# EAGLE design Mini-Q (EAGLE 6.4)
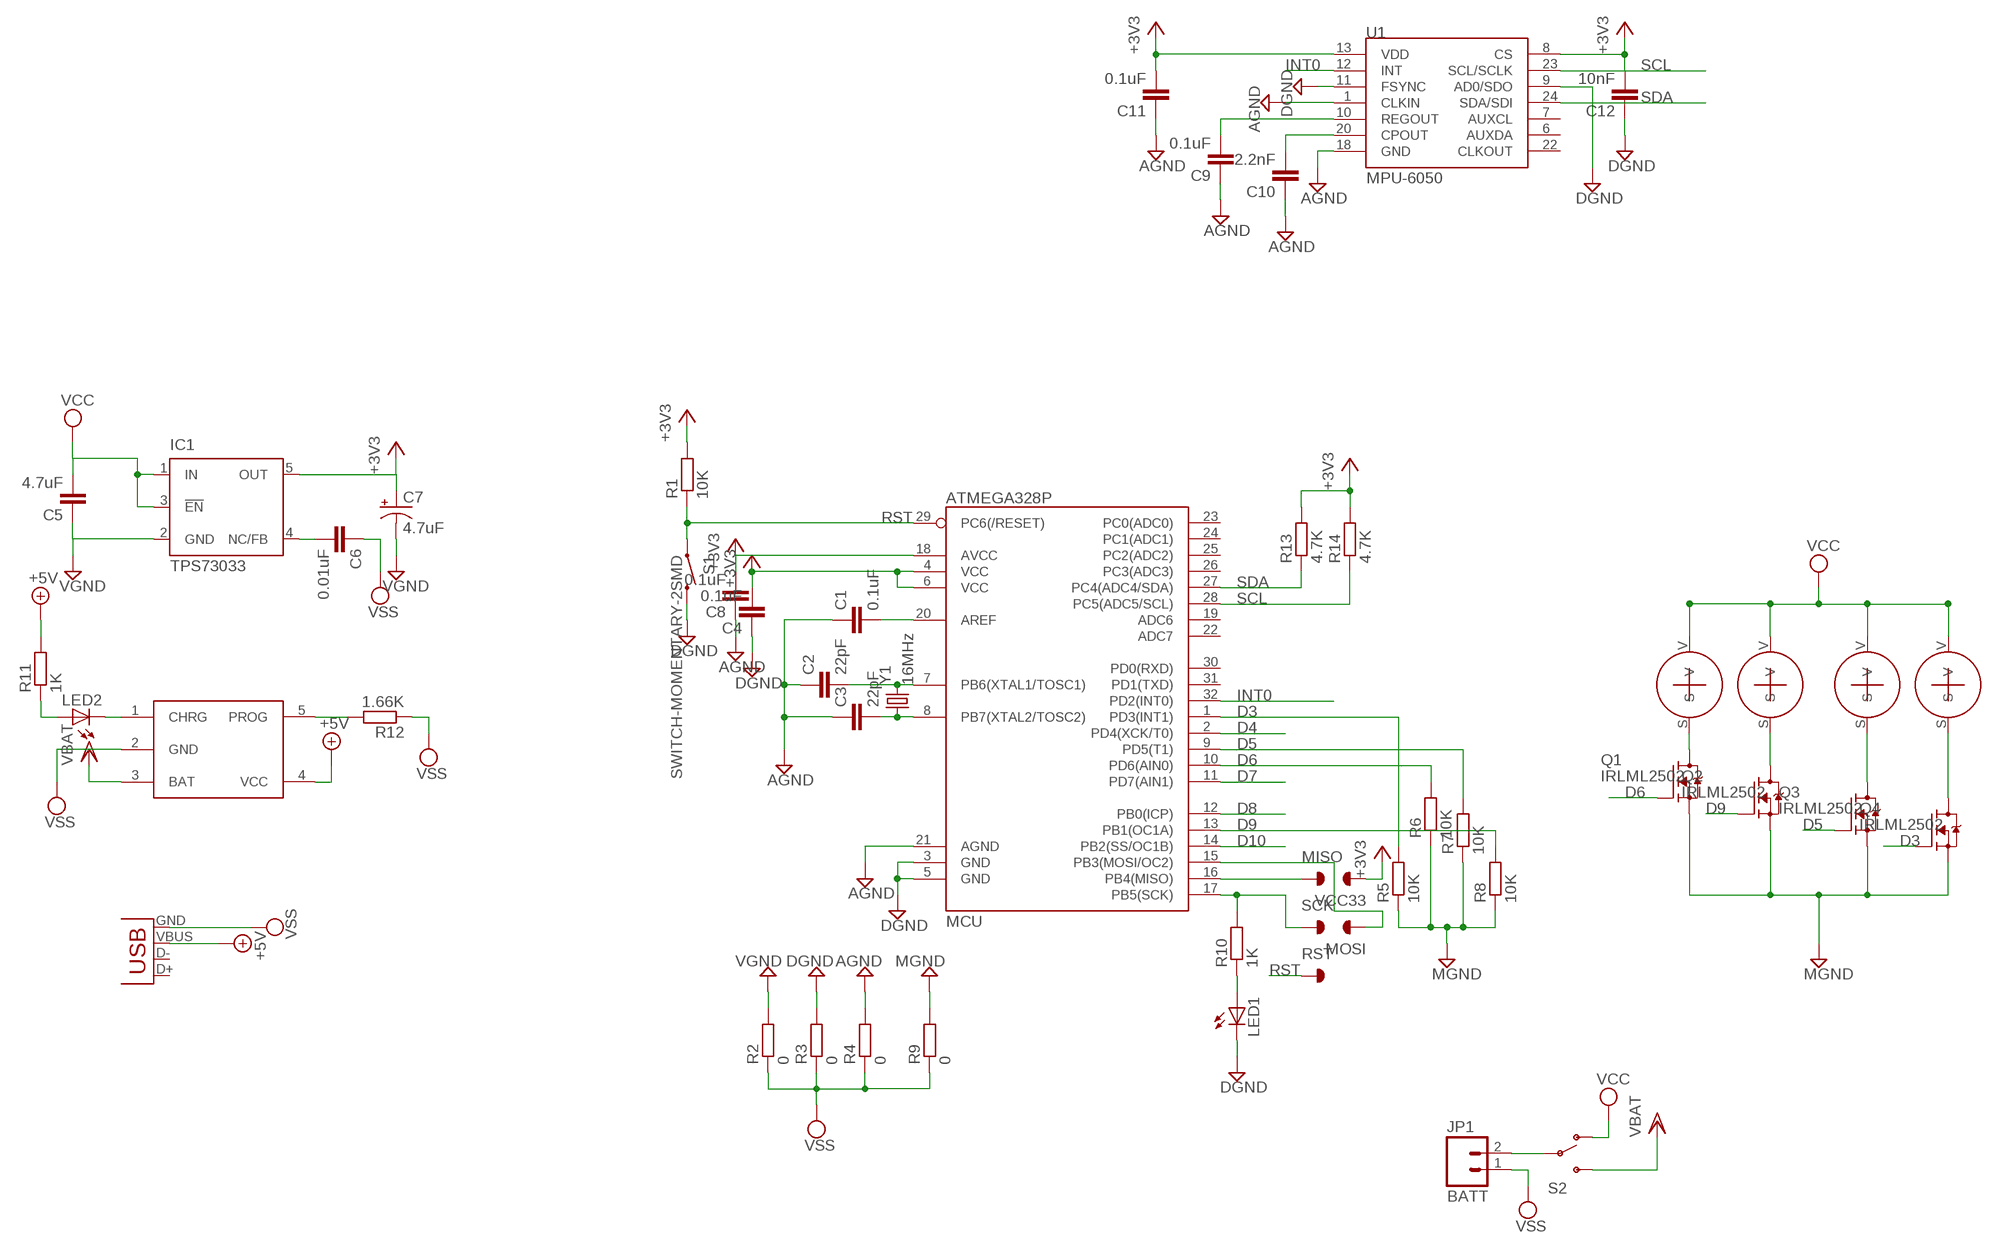
[diagram p0: schematic, sheet 1]

## Parts
C1  0.1uF  C-EUC0805  [C0805]
C2  22pF  C-EUC0603  [C0603]
C3  22pF  C-EUC0603  [C0603]
C4  0.1uF  C-EUC0805  [C0805]
C5  4.7uF  C-EUC0805  [C0805]
C6  0.01uF  C-EUC0805  [C0805]
C7  4.7uF  CAP_POL3528  [EIA3528]
C8  0.1uF  C-EUC0805  [C0805]
C9  0.1uF  C-EUC0805  [C0805]
C10  2.2nF  C-EUC0805  [C0805]
C11  0.1uF  C-EUC0805  [C0805]
C12  10nF  C-EUC0805  [C0805]
IC1  TPS73033  TPS77033  [SOT23-DBV]
JP1  BATT  M02PTH  [1X02]
JP2  USBSMD  [USB-MINIB]
LED1  LEDSML0805  [SML0805]
LED2  LEDSML0805  [SML0805]
MCU  ATMEGA328P  ATMEGA328_SMT  [TQFP32-08]
MISO  xx  POINT  [POINT]
MOSI  xx  POINT  [POINT]
Q1  IRLML2502  [SOT23-3]
Q2  IRLML2502  [SOT23-3]
Q3  IRLML2502  [SOT23-3]
Q4  IRLML2502  [SOT23-3]
R1  10K  R-EU_R0805  [R0805]
R2  0  R-EU_R0805  [R0805]
R3  0  R-EU_R0805  [R0805]
R4  0  R-EU_R0805  [R0805]
R5  10K  R-EU_R0805  [R0805]
R6  10K  R-EU_R0805  [R0805]
R7  10K  R-EU_R0805  [R0805]
R8  10K  R-EU_R0805  [R0805]
R9  0  R-EU_R0805  [R0805]
R10  1K  R-EU_R0805  [R0805]
R11  1K  R-EU_R0805  [R0805]
R12  1.66K  R-EU_R0805  [R0805]
R13  4.7K  R-EU_R0805  [R0805]
R14  4.7K  R-EU_R0805  [R0805]
RST  xx  POINT  [POINT]
S1  SWITCH-MOMENTARY-2SMD  [TACTILE_SWITCH_SMD]
S2  SWITCH-SPDT-SMD-A  [SWITCH-SPST-SMD-A]
SCK  xx  POINT  [POINT]
U1  MPU-6050  MPU-6000QFN-24  [QFN-24-TESTING]
U$1  MOTOR  [MOTOR]
U$2  MOTOR  [MOTOR]
U$3  MOTOR  [MOTOR]
U$4  MOTOR  [MOTOR]
U$5  TP4055  [SOT23-5]
VCC33  xx  POINT  [POINT]
Y1  16MHz  CRYSTALHC49US  [HC49US]

## Nets
+3V3: C4.2 C7.A(+) C8.2 C11.2 C12.2 IC1.5(OUT) MCU.4(VCC) MCU.6(VCC) MCU.18(AVCC) R1.2 R13.2 R14.2 U1.8(CS) U1.13(VDD) VCC33.P$1
+5V: JP2.VBUS R11.2 U$5.4(VCC)
AGND: C1.1 C2.1 C3.1 C8.1 C9.1 C10.1 C11.1 MCU.21(AGND) R4.2 U1.1(CLKIN) U1.18(GND)
D3: MCU.1(PD3(INT1)) Q4.1(G) R5.2
D4: MCU.2(PD4(XCK/T0))
D5: MCU.9(PD5(T1)) Q3.1(G) R7.2
D6: MCU.10(PD6(AIN0)) Q1.1(G) R6.2
D7: MCU.11(PD7(AIN1))
D8: MCU.12(PB0(ICP))
D9: MCU.13(PB1(OC1A)) Q2.1(G) R8.2
D10: MCU.14(PB2(SS/OC1B))
DGND: C4.1 C12.1 LED1.C MCU.3(GND) MCU.5(GND) R3.2 S1.3 U1.9(AD0/SDO) U1.11(FSYNC)
GND1: C5.1 C7.C(-) IC1.2(GND) R2.2 ; supply symbol labelled VGND
GND2: Q1.2(S) Q2.2(S) Q3.2(S) Q4.2(S) R5.1 R6.1 R7.1 R8.1 R9.2 ; supply symbol labelled MGND
INT0: MCU.32(PD2(INT0)) U1.12(INT)
N$5: C1.2 MCU.20(AREF)
N$6: MCU.16(PB4(MISO)) MISO.P$1
N$7: C3.2 MCU.8(PB7(XTAL2/TOSC2)) Y1.1
N$8: C2.2 MCU.7(PB6(XTAL1/TOSC1)) Y1.2
N$9: MCU.17(PB5(SCK)) R10.2 SCK.P$1
N$10: C6.2 IC1.4(NC/FB)
N$11: JP1.2 S2.2(P)
N$12: MCU.15(PB3(MOSI/OC2)) MOSI.P$1
N$13: Q1.3(D) U$1.S
N$14: Q2.3(D) U$2.S
N$15: Q3.3(D) U$3.S
N$16: Q4.3(D) U$4.S
N$17: LED1.A R10.1
N$18: C10.2 U1.20(CPOUT)
N$19: C9.2 U1.10(REGOUT)
N$20: LED2.A R11.1
N$21: LED2.C U$5.1(CHRG)
N$22: R12.2 U$5.5(PROG)
RST: MCU.29(PC6(/RESET)) R1.1 RST.P$1 S1.1
SCL: MCU.28(PC5(ADC5/SCL)) R14.1 U1.23(SCL/SCLK)
SDA: MCU.27(PC4(ADC4/SDA)) R13.1 U1.24(SDA/SDI)
VCC: C5.2 IC1.1(IN) IC1.3(!EN) S2.1(O) U$1.V U$2.V U$3.V U$4.V
VDD: S2.3(S) U$5.3(BAT) ; supply symbol labelled VBAT
VSS: C6.1 JP1.1 JP2.GND R2.1 R3.1 R4.1 R9.1 R12.1 U$5.2(GND)
Unconnected: JP2.D+ JP2.D- MCU.19(ADC6) MCU.22(ADC7) MCU.23(PC0(ADC0)) MCU.24(PC1(ADC1)) MCU.25(PC2(ADC2)) MCU.26(PC3(ADC3)) MCU.30(PD0(RXD)) MCU.31(PD1(TXD)) U1.6(AUXDA) U1.7(AUXCL) U1.22(CLKOUT)

## Library data of the parts
C1-C6 C8-C12 = resistor:C-EU: CAPACITOR, European symbol
C7 = SparkFun-Passives:CAP_POL: Capacitor Polarized These are standard SMD and PTH capacitors. Normally 10uF, 47uF, and 100uF in electrolytic and tantalum varieties. Always verify the external diameter of the through hole cap, it varies with capacity, voltage, and manufacturer. The EIA devices should be standard.
IC1 = texas:TPS770*: ULTRALOW-POWER 50-mA LOW-DROPOUT LINEAR REGULATORS 50-mA Low-Dropout Regulator Source: http://focus.ti.com/lit/ds/symlink/tps77001.pdf; MF: TEXAS INSTRUMENTS; MPN: TPS77033DBVT; OC_FARNELL: 8461570; OC_NEWARK: 77C1187
JP1 = SparkFun-Connectors:M02: Header 2 Standard 2-pin 0.1" header. Use with straight break away headers (SKU : PRT-00116), right angle break away headers (PRT-00553), swiss pins (PRT-00743), machine pins (PRT-00117), and female headers (PRT-00115). Molex polarized connector foot print use with SKU : PRT-08233 with associated crimp pins and housings.
JP2 = SparkFun-Connectors:USB: USB Connectors USB-B-PTH is fully proven SKU : PRT-00139/CONN-08278 USB-miniB is fully proven SKU : PRT-00587 USB-A-PCB is untested. USB-A-H is throughly reviewed, but untested. Spark Fun Electronics SKU : PRT-00437 USB-B-SMT is throughly reviewed, but untested. Needs silkscreen touching up. USB-A-S has not been used/tested USB-MB-H has not been used/tested USB-MICROB has been used. CONN-09505
LED1 LED2 = led:LED: LED OSRAM: - CHIPLED LG R971, LG N971, LY N971, LG Q971, LY Q971, LO R971, LY R971 LH N974, LH R974 LS Q976, LO Q976, LY Q976 LO Q996 - Hyper CHIPLED LW Q18S LB Q993, LB Q99A, LB R99A - SideLED LS A670, LO A670, LY A670, LG A670, LP A670 LB A673, LV A673, LT A673, LW A673 LH A674 LY A675 LS A676, LA A676, LO A676, LY A676, LW A676 LS A679, LY A679, LG A679 - Hyper Micro SIDELED® LS Y876, LA Y876, LO Y876, LY Y876 LT Y87S - SmartLED LW L88C, LW L88S LB L89C, LB L89S, LG L890 LS L89K, LO L89K, LY L89K LS L896, LA L896, LO L896, LY L896 - TOPLED LS T670, LO T670, LY T670, LG T670, LP T670 LSG T670, LSP T670, LSY T670, LOP T670, LYG T670 LG T671, LOG T671, LSG T671 LB T673, LV T673, LT T673, LW T673 LH T674 LS T676, LA T676, LO T676, LY T676, LB T676, LH T676, LSB T676, LW T676 LB T67C, LV T67C, LT T67C, LS T67K, LO T67K, LY T67K, LW E67C LS E67B, LA E67B, LO E67B, LY E67B, LB E67C, LV E67C, LT E67C LW T67C LS T679, LY T679, LG T679 LS T770, LO T770, LY T770, LG T770, LP T770 LB T773, LV T773, LT T773, LW T773 LH T774 LS E675, LA E675, LY E675, LS T675 LS T776, LA T776, LO T776, LY T776, LB T776 LHGB T686 LT T68C, LB T68C - Hyper Mini TOPLED® LB M676 - Mini TOPLED Santana® LG M470 LS M47K, LO M47K, LY M47K Source: http://www.osram.convergy.de LUXEON: - LUMILED® LXK2-PW12-R00, LXK2-PW12-S00, LXK2-PW14-U00, LXK2-PW14-V00 LXK2-PM12-R00, LXK2-PM12-S00, LXK2-PM14-U00 LXK2-PE12-Q00, LXK2-PE12-R00, LXK2-PE12-S00, LXK2-PE14-T00, LXK2-PE14-U00 LXK2-PB12-K00, LXK2-PB12-L00, LXK2-PB12-M00, LXK2-PB14-N00, LXK2-PB14-P00, LXK2-PB14-Q00 LXK2-PR12-L00, LXK2-PR12-M00, LXK2-PR14-Q00, LXK2-PR14-R00 LXK2-PD12-Q00, LXK2-PD12-R00, LXK2-PD12-S00 LXK2-PH12-R00, LXK2-PH12-S00 LXK2-PL12-P00, LXK2-PL12-Q00, LXK2-PL12-R00 Source: www.luxeon.com KINGBRIGHT: KA-3528ASYC Source: www.kingbright.com
MCU = SparkFun-DigitalIC:ATMEGA328_SMT: 32-Pin Atmega328 part Commonly used on Arduino compatible boards Available in QFP and QFN packages TQFP is IC-09069 QFN is non-stock; PROD_ID: IC-09069
MISO MOSI RST SCK VCC33 = Mini-Q:POINT
Q1-Q4 = xmaker:IRLML2502: International Rectifier N-MOSFET.
R1-R14 = resistor:R-EU_: RESISTOR, European symbol
S1 = SparkFun-Electromechanical:SWITCH-MOMENTARY-2: Various NO switches- pushbuttons, reed, etc
S2 = SparkFun-Electromechanical:SWITCH-SPDT: SPDT Switch Simple slide switch, Spark Fun Electronics SKU : COM-00102 DPDT SMT slide switch, AYZ0202, SWCH-08179
U1 = SparkFun-Sensors:MPU-6000: MPU-6000 - I2C address is 0x68 with AD0 low and 0x69 with AD0 high.
U$1-U$4 = Mini-Q:MOTOR
U$5 = Mini-Q:TP4055
Y1 = SparkFun-FreqCtrl:CRYSTAL: Various standard crystals. Proven footprints. Spark Fun Electronics SKU : COM-00534

## Board
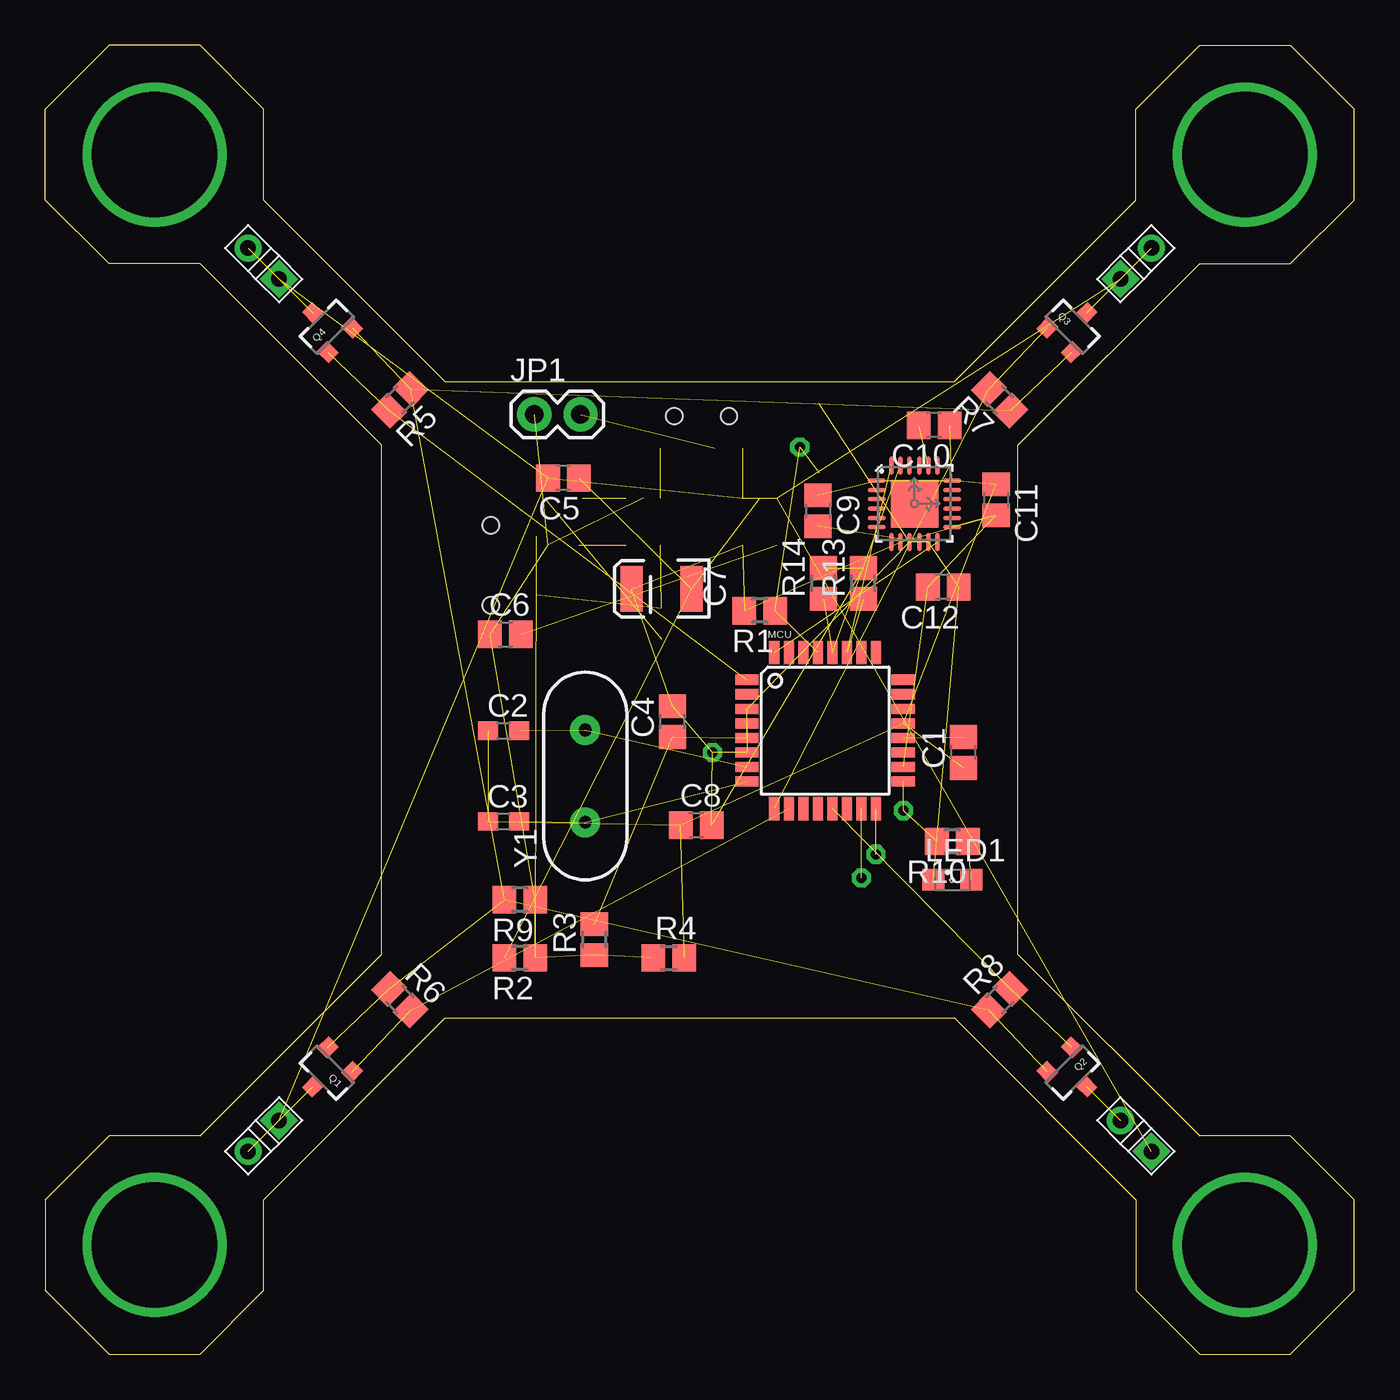
[diagram p1: board, top side]
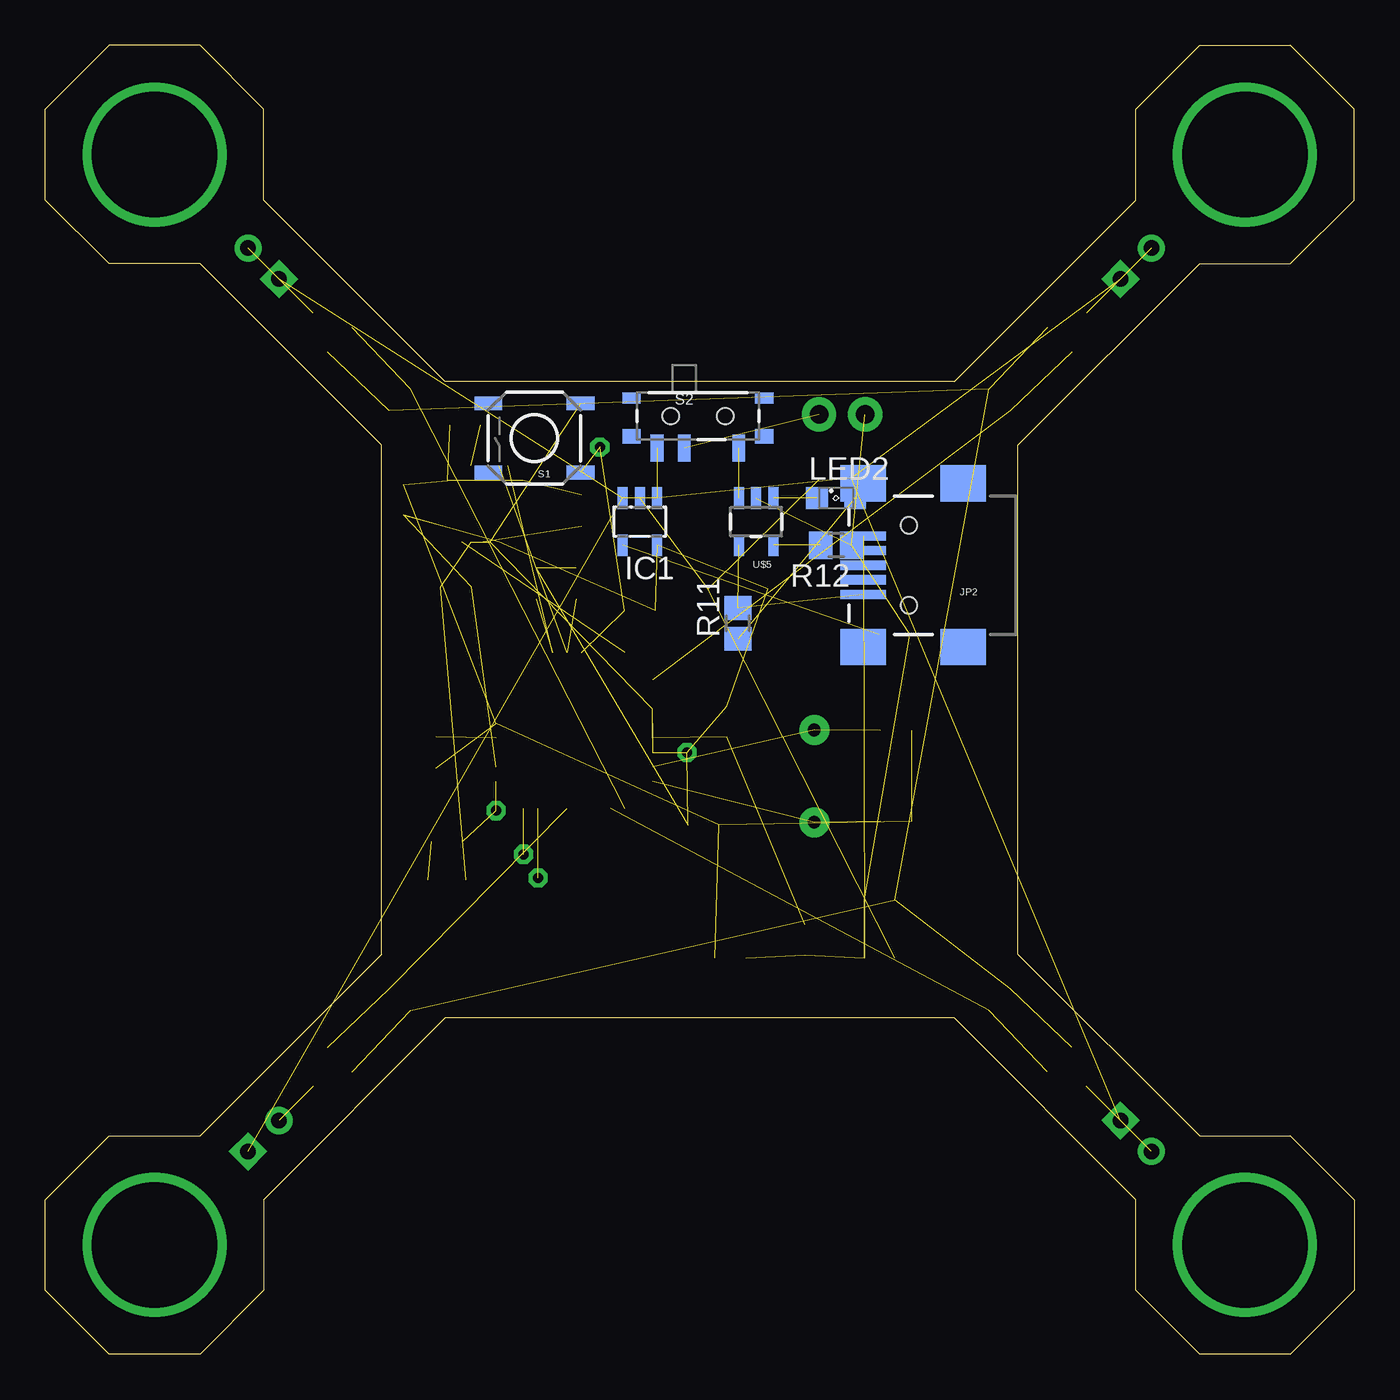
[diagram p2: board, bottom side, seen from below]

Size 72 x 72 mm. Coordinates in mm from the lower left corner, seen from the top.
Outline: 3.5,0 8.5,0 12,3.5 12,8.5 22,18.5 50,18.5 60,8.5 60,3.5 63.5,0 68.5,0 72,3.5 72,8.5 68.5,12 63.5,12 53.5,22 53.5,50 63.5,60 68.5,60 72,63.5 72,68.5 68.5,72 63.5,72 60,68.5 60,63.5 50,53.5 22,53.5 12,63.5 12,68.5 8.5,72 3.5,72 0,68.5 0,63.5 3.5,60 8.5,60 18.5,50 18.5,22 8.5,12 3.5,12 0,8.5 0,3.5 3.5,0
Copper layers (1*16): Top 0.035mm / dielectric 1.5mm / Bottom 0.035mm
Design rules "default": minimum track width 10mil, minimum drill 24mil, track to track 8mil, track to pad 8mil, pad to pad 8mil, via to via 8mil, smd to smd 8mil, copper to edge 40mil, drill to drill 8mil, minimum pad ring 10mil, minimum via ring 8mil, stop-mask expansion 4mil, vias tented up to drill 0mil, thermal gap 10mil

### Footprints (pad centres in the part's own frame; a part is rotated, then mirrored left to right if it is on the bottom)
C0805 = smd 1.3 x 1.5: 1 -0.85,0; 2 0.85,0
C0603 = smd 1.1 x 1: 1 -0.85,0; 2 0.85,0
EIA3528 = smd 1.2 x 2.5: A 1.65,0; C -1.65,0
SOT23-DBV = smd 0.55 x 1.2: 1 -0.95,-1.3; 2 0,-1.3; 3 0.95,-1.3; 4 0.95,1.3; 5 -0.95,1.3
1X02 = drill 1.016 pad 1.88: 1 0,0; 2 2.54,0
USB-MINIB = smd 2.5 x 0.5: D+ 2.5,0; D- 2.5,0.8; GND 2.5,-1.6; ID 2.5,-0.8; VBUS 2.5,1.6 | smd 2.5 x 2: MTN1 -3,4.5; MTN2 2.5,4.5; MTN3 -3,-4.5; MTN4 2.5,-4.5 | hole 0.9: 0,2.2; 0,-2.2
SML0805 = smd 1.2 x 1.2: A 1.05,0; C -1.05,0
TQFP32-08 = smd 1.27 x 0.559: 1 -4.293,2.8; 2 -4.293,2; 3 -4.293,1.2; 4 -4.293,0.4; 5 -4.293,-0.4; 6 -4.293,-1.2; 7 -4.293,-2; 8 -4.293,-2.8; 17 4.293,-2.8; 18 4.293,-2; 19 4.293,-1.2; 20 4.293,-0.4; 21 4.293,0.4; 22 4.293,1.2; 23 4.293,2; 24 4.293,2.8 | smd 0.559 x 1.27: 9 -2.8,-4.293; 10 -2,-4.293; 11 -1.2,-4.293; 12 -0.4,-4.293; 13 0.4,-4.293; 14 1.2,-4.293; 15 2,-4.293; 16 2.8,-4.293; 25 2.8,4.293; 26 2,4.293; 27 1.2,4.293; 28 0.4,4.293; 29 -0.4,4.293; 30 -1.2,4.293; 31 -2,4.293; 32 -2.8,4.293
POINT = drill 0.55 octagon: P$1 0,0
SOT23-3 = smd 0.8 x 0.9: 1 -0.95,-1; 2 0.95,-1; 3 0,1.1
R0805 = smd 1.3 x 1.5: 1 -0.85,0; 2 0.85,0
TACTILE_SWITCH_SMD = smd 1.524 x 0.762: 1 -2.54,1.905; 2 2.54,1.905; 3 -2.54,-1.905; 4 2.54,-1.905
SWITCH-SPST-SMD-A = smd 0.7 x 1.5: 1 -2.25,-1.75; 2 -0.75,-1.75; 3 2.25,-1.75 | smd 1 x 0.6: GND1 -3.65,1; GND3 3.65,1 | smd 1 x 0.8: GND2 -3.65,-1.1; GND4 3.65,-1.1 | hole 0.9: -1.5,0; 1.5,0
QFN-24-TESTING = smd 1.016 x 0.254: 1 -2.066,1.257; 2 -2.066,0.75; 3 -2.066,0.247; 4 -2.066,-0.287; 5 -2.066,-0.792; 6 -2.066,-1.297; 13 2.086,-1.297; 14 2.086,-0.792; 15 2.086,-0.287; 16 2.086,0.247; 17 2.086,0.75; 18 2.086,1.257 | smd 0.254 x 1.016: 7 -1.267,-2.122; 8 -0.762,-2.122; 9 -0.258,-2.122; 10 0.278,-2.122; 11 0.78,-2.122; 12 1.287,-2.122; 19 1.287,2.082; 20 0.78,2.082; 21 0.278,2.082; 22 -0.258,2.082; 23 -0.762,2.082; 24 -1.267,2.082 | smd 2.616 x 2.616: P$1 0.02,-0.01
MOTOR = drill 0.85 pad 1.5: S 1.2,0 | drill 0.85 pad 1.5 square: V -1.2,0
SOT23-5 = smd 0.55 x 1.2: 1 -0.95,-1.3; 2 0,-1.3; 3 0.95,-1.3; 4 0.95,1.3; 5 -0.95,1.3
HC49US = drill 0.7 pad 1.651: 1 -2.54,0; 2 2.54,0

### Placement (x,y rotation side)
C1  50.5,33.1 90 top
C2  25.2,34.3 0 top
C3  25.2,29.3 0 top
C4  34.5,34.8 90 top
C5  28.5,48.2 180 top
C6  25.3,39.6 0 top
C7  33.9,42.1 180 top
C8  35.8,29.1 0 top
C9  42.5,46.4 270 top
C10  48.9,51.1 180 top
C11  52.3,47 270 top
C12  49.4,42.2 180 top
IC1  39.3,45.8 180 bottom
JP1  26.9,51.7 0 top
JP2  24.5,43.4 180 bottom
LED1  49.9,26.1 0 top
LED2  28.5,47.1 0 bottom
MCU  42.9,34.3 0 top
MISO  45.7,27.5 0 top
MOSI  44.9,26.2 0 top
Q1  15.5,15.5 135 top
Q2  56.5,15.5 225 top
Q3  56.5,56.5 315 top
Q4  15.5,56.5 45 top
R1  39.3,40.9 180 top
R2  26.1,21.8 180 top
R3  30.2,22.8 90 top
R4  34.3,21.8 0 top
R5  19.5,52.5 225 top
R6  19.5,19.5 315 top
R7  52.5,52.5 135 top
R8  52.5,19.5 45 top
R9  26.1,25 180 top
R10  49.9,28.2 180 top
R11  33.9,40.2 90 bottom
R12  28.5,44.5 180 bottom
R13  45,42.4 90 top
R14  42.8,42.4 90 top
RST  41.5,49.9 0 top
S1  45.1,50.4 180 bottom
S2  36.1,51.6 0 bottom
SCK  47.2,29.9 0 top
U1  47.8,46.8 0 top
U$1  12,12 225 top
U$2  60,12 135 top
U$3  60,60 45 top
U$4  12,60 135 top
U$5  32.9,45.8 180 bottom
VCC33  36.7,33.1 0 top
Y1  29.7,31.8 90 top

### Tracks (layer width: path | path; a pad name or v marks a point on that pad's centre or on a via)
+3V3  (14 unrouted)
+5V  (2 unrouted)
AGND  (10 unrouted)
D3  (2 unrouted)
D5  (2 unrouted)
D6  (2 unrouted)
D9  (2 unrouted)
DGND  (8 unrouted)
GND1  (3 unrouted)
GND2  (8 unrouted)
INT0  (1 unrouted)
N$1  (via drill 6.9)
  other vias: 6,6
N$2  (via drill 6.9)
  other vias: 66,6
N$3  (via drill 6.9)
  other vias: 6,66
N$4  (via drill 6.9)
  other vias: 66,66
N$5  (1 unrouted)
N$6  (1 unrouted)
N$7  (2 unrouted)
N$8  (2 unrouted)
N$9  (2 unrouted)
N$10  (1 unrouted)
N$11  (1 unrouted)
N$12  (1 unrouted)
N$13  (1 unrouted)
N$14  (1 unrouted)
N$15  (1 unrouted)
N$16  (1 unrouted)
N$17  (1 unrouted)
N$18  (1 unrouted)
N$19  (1 unrouted)
N$20  (1 unrouted)
N$21  (1 unrouted)
N$22  (1 unrouted)
RST  (3 unrouted)
SCL  (2 unrouted)
SDA  (2 unrouted)
VCC  (7 unrouted)
VDD  (1 unrouted)
VSS  (8 unrouted)